# Altium project PCB_Project_1_board.PrjPcb
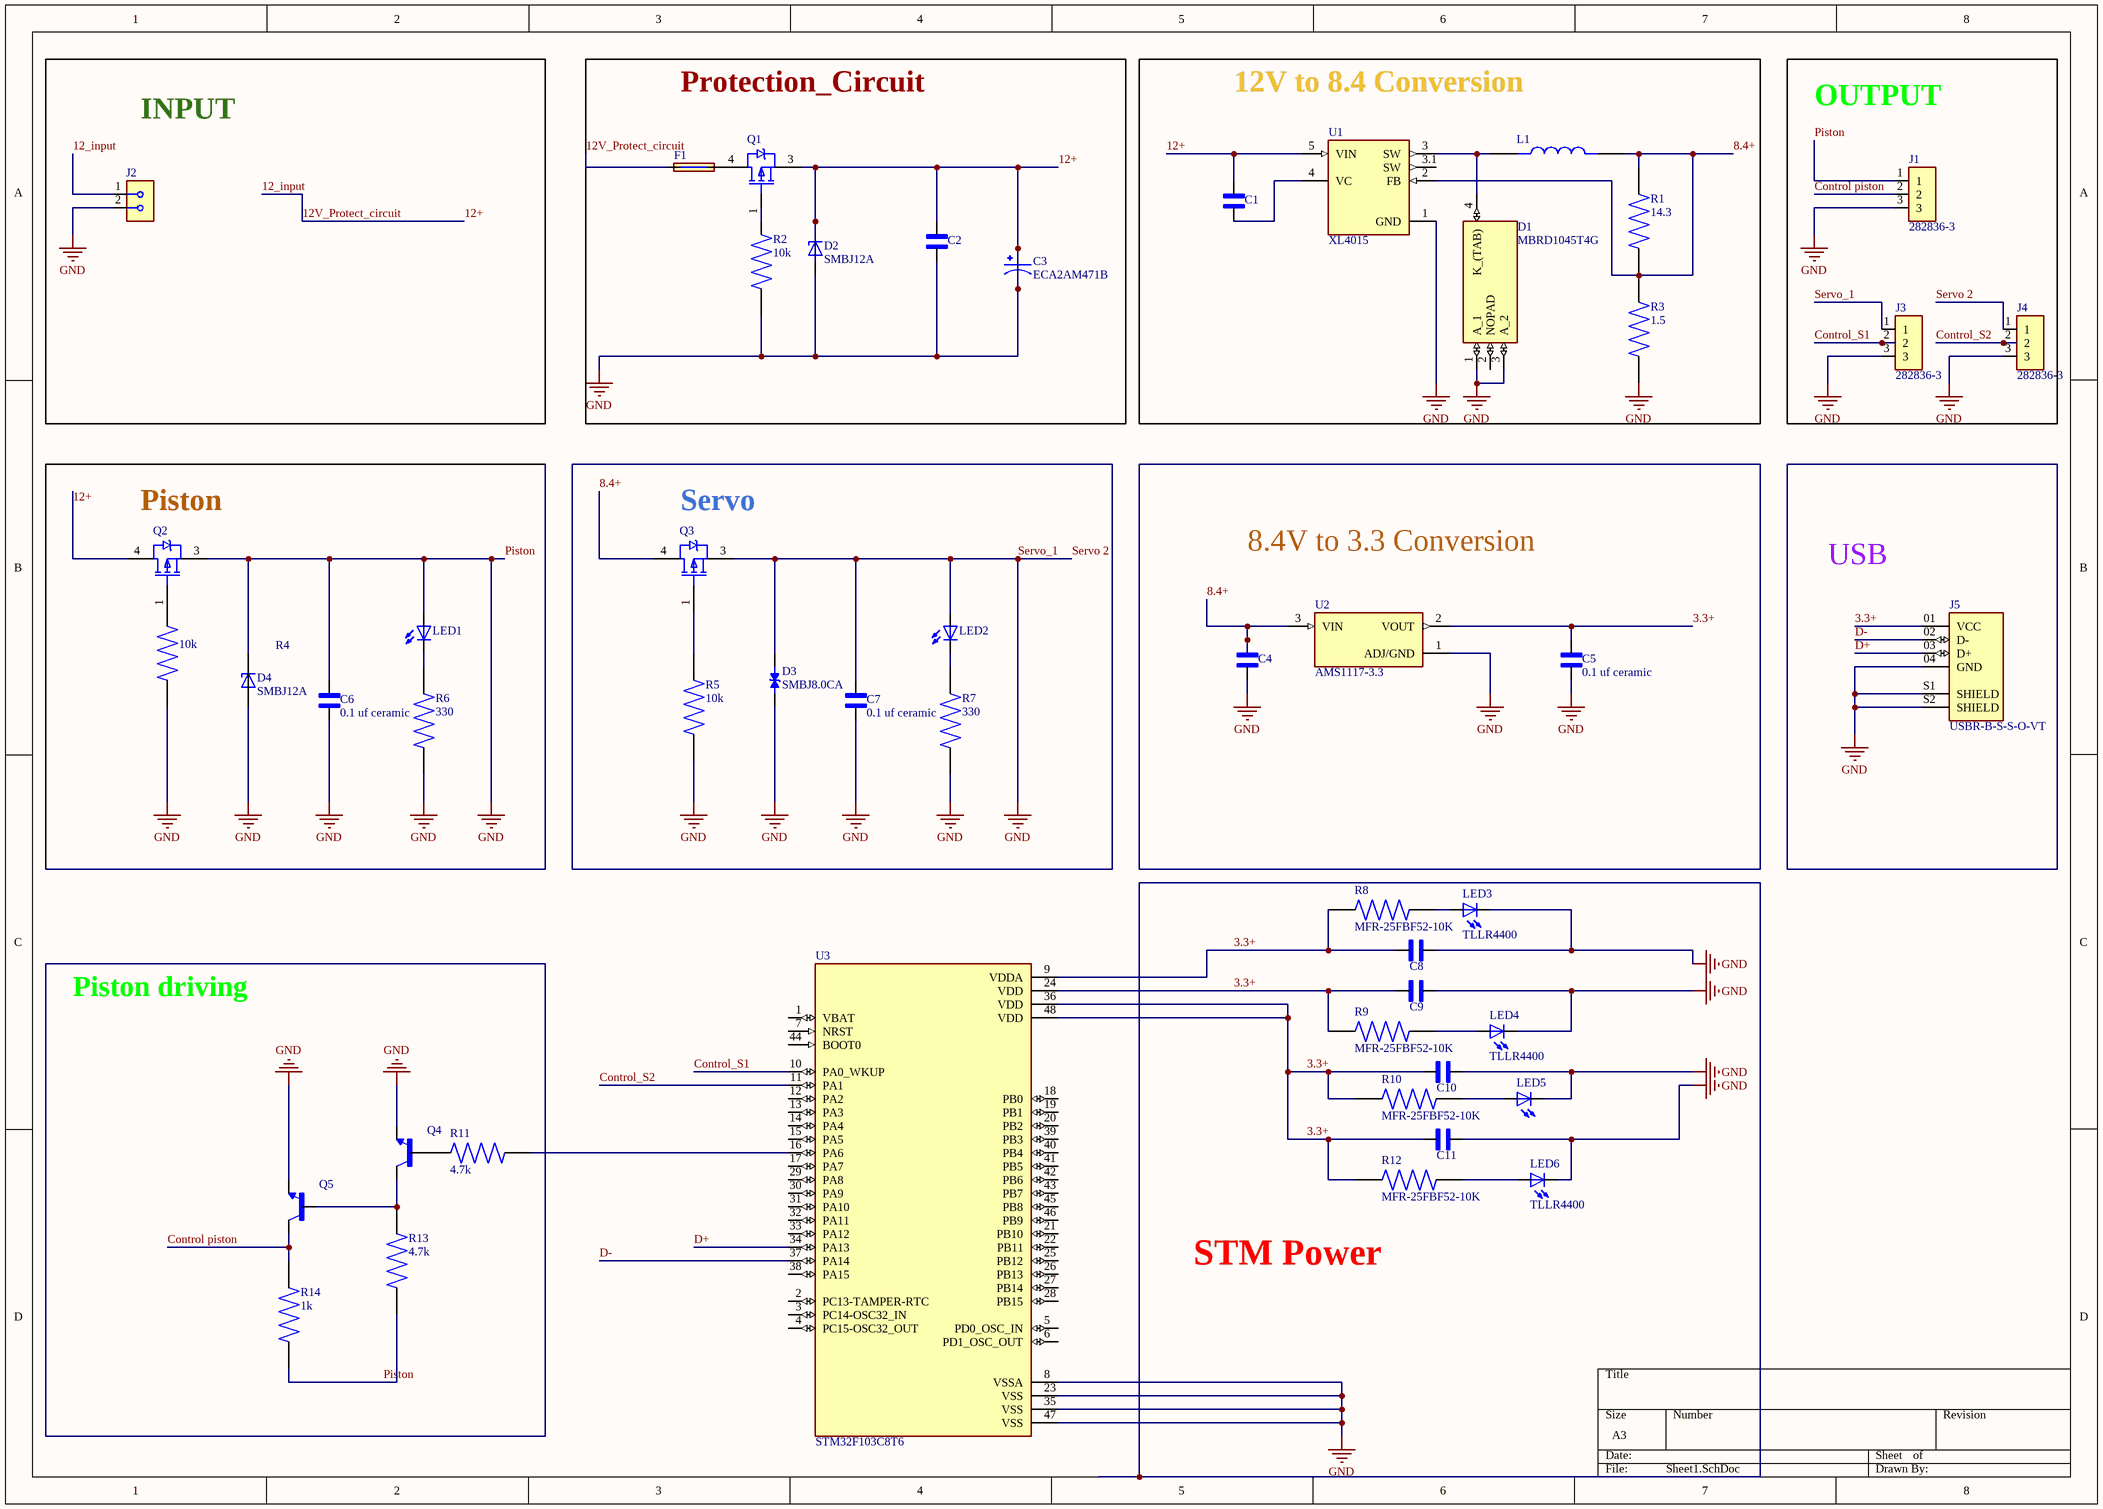
[diagram p0: Sheet1.SchDoc]
1 sheet, 50 parts. Net scope: global (net labels, ports and power ports of the same name join across sheets).
Board file: PCB1.PcbDoc

## Sheet Sheet1.SchDoc
size A3; SheetNumber: 1; SheetTotal: 1

### Parts
C1  CL10B105KO8NNNC  [CAPC1608X90N]  (value not drawn)
C2  FA14X8R1H104KNU06  [CAPRB250W50L450T300H550]  (value not drawn)
C3  ECA2AM471B  [CAPPRD750W80D1600H2500]
C4  0.1 uf ceramic  [CAPRB250W50L450T300H550]  (value not drawn)
C5  0.1 uf ceramic  [CAPRB250W50L450T300H550]
C6  0.1 uf ceramic  [CAPRB250W50L450T300H550]
C7  0.1 uf ceramic  [CAPRB250W50L450T300H550]
C8  0.1 uf ceramic  [CAPRB250W50L450T300H550]  (value not drawn)
C9  0.1 uf ceramic  [CAPRB250W50L450T300H550]  (value not drawn)
C10  0.1 uf ceramic  [CAPRB250W50L450T300H550]  (value not drawn)
C11  0.1 uf ceramic  [CAPRB250W50L450T300H550]  (value not drawn)
D1  MBRD1045T4G  [TO229P990X238-4N]
D2  SMBJ12A  [DIOM4336X265N]
D3  SMBJ8.0CA  [DIOM4336X265N]
D4  SMBJ12A  [DIOM4336X265N]
F1  0154007.DR  [0154007.DR]  (value not drawn)
J1  282836-3  [TE_282836-3]
J2  OSTTF020161  [OST_OSTTF020161]  (value not drawn)
J3  282836-3  [TE_282836-3]
J4  282836-3  [TE_282836-3]
J5  USBR-B-S-S-O-VT  [SAMTEC_USBR-B-S-S-O-VT]
L1  AMDLA1004S-470MT  [IND_AMDLA1004S-470MT]  (value not drawn)
LED1  TLLR4400  [LED3MM]  (value not drawn)
LED2  TLLR4400  [LED3MM]  (value not drawn)
LED3  TLLR4400  [LED3MM]
LED4  TLLR4400  [LED3MM]
LED5  TLLR4400  [LED3MM]  (value not drawn)
LED6  TLLR4400  [LED3MM]
Q1  MTB50P03HDLT4G  [ONSC-D2PAK-3-418B-04_V]  (value not drawn)
Q2  MTB50P03HDLT4G  [ONSC-D2PAK-3-418B-04_V]  (value not drawn)
Q3  MTB50P03HDLT4G  [ONSC-D2PAK-3-418B-04_V]  (value not drawn)
Q4  2N3904  [TO92254P460H750-3]  (value not drawn)
Q5  2N3904  [TO92254P460H750-3]  (value not drawn)
R1  14.3  [RESAD1100W55L680D260]
R2  10k  [RESAD1100W55L680D260]
R3  1.5  [RESAD1100W55L680D260]
R4  10k  [RESAD1100W55L680D260]
R5  10k  [RESAD1100W55L680D260]
R6  330  [RESAD1100W55L680D260]
R7  330  [RESAD1100W55L680D260]
R8  MFR-25FBF52-10K  [RESAD1100W55L680D260]
R9  MFR-25FBF52-10K  [RESAD1100W55L680D260]
R10  MFR-25FBF52-10K  [RESAD1100W55L680D260]
R11  4.7k  [RESAD1100W55L680D260]
R12  MFR-25FBF52-10K  [RESAD1100W55L680D260]
R13  4.7k  [RESAD1100W55L680D260]
R14  1k  [RESAD1100W55L680D260]
U1  XL4015  [CONV_XL4015]
U2  AMS1117-3.3  [SOT229P700X180-4N]
U3  STM32F103C8T6  [QFP50P900X900X160-48N]

### Blocks framed on the sheet
INPUT: J2
Protection_Circuit: C2 C3 D2 F1 Q1 R2
12V to 8.4 Conversion: C1 D1 L1 R1 R3 U1
OUTPUT: J1 J3 J4

### Nets
12+: C1.2 C2.1 C2.2 C3.N C3.P C4.1 C5.1 C6.1 C6.2 C7.1 C7.2 C8.1 C9.1 C10.1 C11.1 D1.1(A_1) D1.3(A_2) D2.A D2.C D3.1 D3.2 D4.A D4.C F1.1 J1.1 J1.3 J2.1 J2.2 J3.1 J3.3 J4.1 J4.3 J5.04(GND) J5.S1(SHIELD) J5.S2(SHIELD) LED1.A LED2.A LED3.K(C) LED4.K(C) LED5.K(C) LED6.K(C) Q1.3(S) Q2.3(S) Q2.4(D) Q3.3(S) Q4.1(E) Q5.1(E) R2.1 R3.1 R4.1 R5.1 R6.1 R7.1 R13.1 R14.1 U1.1(GND) U1.5(VIN) U2.1(ADJ/GND) U3.8(VSSA) U3.23(VSS) U3.35(VSS) U3.47(VSS)  [also labelled 12_input, 12V_Protect_circuit, GND, Piston, Servo 2, Servo_1]
3.3+: C5.2 C8.2 C9.2 C10.2 C11.2 J5.01(VCC) R8.1 R9.1 R10.1 R12.1 U2.2(VOUT) U3.9(VDDA) U3.24(VDD) U3.36(VDD) U3.48(VDD)
8.4+: C4.2 L1.2 Q3.4(D) R1.1 R1.2 R3.2 U1.2(FB) U2.3(VIN)
Control piston: J1.2 Q5.3(C) R14.2
Control_S1: J3.2 U3.10(PA0_WKUP)
Control_S2: J4.2 U3.11(PA1)
D+: J5.03(D+) U3.34(PA13)
D-: J5.02(D-) U3.37(PA14)
NetC1_1: C1.1 U1.4(VC)
NetD1_4: D1.4(K_(TAB)) L1.1 U1.3(SW)
NetF1_2: F1.2 Q1.4(D)
NetLED1_K: LED1.K(C) R6.2
NetLED2_K: LED2.K(C) R7.2
NetLED3_A: LED3.A R8.2
NetLED4_A: LED4.A R9.2
NetLED5_A: LED5.A R10.2
NetLED6_A: LED6.A R12.2
NetQ1_1: Q1.1(G) R2.2
NetQ3_1: Q3.1(G) R5.2
NetQ4_2: Q4.2(B) R11.1
NetQ4_3: Q4.3(C) Q5.2(B) R13.2
NetR11_2: R11.2 U3.16(PA6)

Not connected (* = marked no-connect by the designer): D1 2(NOPAD); Q2 1(G); R4 2; U1 3.1(SW); U3 1(VBAT) 2(PC13-TAMPER-RTC) 3(PC14-OSC32_IN) 4(PC15-OSC32_OUT) 5(PD0_OSC_IN) 6(PD1_OSC_OUT) 7(NRST) 12(PA2) 13(PA3) 14(PA4) 15(PA5) 17(PA7) 18(PB0) 19(PB1) 20(PB2) 21(PB10) 22(PB11) 25(PB12) 26(PB13) 27(PB14) 28(PB15) 29(PA8) 30(PA9) 31(PA10) 32(PA11) 33(PA12) 38(PA15) 39(PB3) 40(PB4) 41(PB5) 42(PB6) 43(PB7) 44(BOOT0) 45(PB8) 46(PB9)

### Notes on the sheet
- (near Q2) Piston
- (near Q3) Servo
- 8.4V to 3.3 Conversion
- USB
- Piston driving
- STM Power

### Library data of the parts
C1 = CL10B105KO8NNNC: 1 µF Â±10% 16V Ceramic Capacitor X7R 0603 (1608 Metric); MF: Samsung Electro-Mechanics; SnapEDA_Link: https://www.snapeda.com/parts/CL10B105KO8NNNC/Samsung/view-part/?ref=snap; Package: SMD-2 Samsung; Value: *; MP: CL10B105KO8NNNC; Check_prices: https://www.snapeda.com/parts/CL10B105KO8NNNC/Samsung/view-part/?ref=eda
C2 C4-C11 = FA14X8R1H104KNU06: 0.1 ÂµF Â±10% 50V Ceramic Capacitor X8R Radial; MF: TDK; SnapEDA_Link: https://www.snapeda.com/parts/FA14X8R1H104KNU06/TDK/view-part/?ref=snap; Package: Radial TDK; Value: *; MP: FA14X8R1H104KNU06; Check_prices: https://www.snapeda.com/parts/FA14X8R1H104KNU06/TDK/view-part/?ref=eda
C3 = ECA2AM471B: CAP ALUM 470UF 20% 100V RADIAL; MF: Panasonic; Check_prices: https://www.snapeda.com/parts/ECA2AM471B/Panasonic/view-part/?ref=eda; SnapEDA_Link: https://www.snapeda.com/parts/ECA2AM471B/Panasonic/view-part/?ref=snap; Availability: In Stock; Value: *; Price: None; MP: ECA2AM471B; Package: RADIAL-2 Panasonic; Purchase-URL: https://pricing.snapeda.com/search/part/ECA2AM471B/?ref=eda
D1 = MBRD1045T4G: Diode Schottky 45 V 10A Surface Mount DPAK; MF: ON Semiconductor; SnapEDA_Link: https://www.snapeda.com/parts/MBRD1045T4G/Onsemi/view-part/?ref=snap; Package: DPAK-3 ON Semiconductor; Value: *; MP: MBRD1045T4G; Check_prices: https://www.snapeda.com/parts/MBRD1045T4G/Onsemi/view-part/?ref=eda
D2 D4 = SMBJ12A: 600W, 14V, 5%, Unidirectional, TVS; MF: Taiwan Semiconductor Corporation; SnapEDA_Link: https://www.snapeda.com/parts/SMBJ12A/taiwan/view-part/?ref=snap; Package: SMD-2 Taiwan Semiconductor; Value: *; MP: SMBJ12A; Check_prices: https://www.snapeda.com/parts/SMBJ12A/taiwan/view-part/?ref=eda
D3 = SMBJ8.0CA: 600W, 9.4V, 5%, Bidirectional, TVS; MF: Taiwan Semiconductor; SnapEDA_Link: https://www.snapeda.com/parts/SMBJ8.0CA/taiwan/view-part/?ref=snap; Package: SMB Taiwan Semiconductor; Value: *; MP: SMBJ8.0CA; Check_prices: https://www.snapeda.com/parts/SMBJ8.0CA/taiwan/view-part/?ref=eda
F1 = 0154007.DR: 7 A 125 V AC 125 V DC Fuse Board Mount (Cartridge Style Excluded) Requires Holder, Surface Mount 2-SMD, Square End Block with Holder; MF: Littelfuse Inc.; Package: SMD-2 Littelfuse; Price: None; Check_prices: https://www.snapeda.com/parts/0154007.DR/Littelfuse+Inc./view-part/?ref=eda; Value: *; SnapEDA_Link: https://www.snapeda.com/parts/0154007.DR/Littelfuse+Inc./view-part/?ref=snap; MP: 0154007.DR; Availability: In Stock; Purchase-URL: https://pricing.snapeda.com/search?q=0154007.DR&ref=eda
J1 J3 J4 = 282836-3: TERM BLOCK 3POS SIDE ENTRY 5MM; Price: None; Value: *; Package: None; Availability: Unavailable; MP: 282836-3
J2 = OSTTF020161: 2 Position Wire to Board Terminal Block Vertical with Board 0.138 (3.50mm) Through Hole; MF: On Shore; SnapEDA_Link: https://www.snapeda.com/parts/OSTTF020161/ON/view-part/?ref=snap; Package: None; Value: *; MP: OSTTF020161; Check_prices: https://www.snapeda.com/parts/OSTTF020161/ON/view-part/?ref=eda
J5 = USBR-B-S-S-O-VT: MF: Samtec; Package: None; Value: *; MP: USBR-B-S-S-O-VT; Availability: Unavailable; Price: None
L1 = AMDLA1004S-470MT: FIXED IND 47UH 3.5A 143MOHM SMD; MF: Abracon LLC; MP: AMDLA1004S-470MT; Package: Package; Purchase-URL: https://pricing.snapeda.com/search/part/AMDLA1004S-470MT/?ref=eda; Check_prices: https://www.snapeda.com/parts/AMDLA1004S-470MT/Abracon+LLC/view-part/?ref=eda; SnapEDA_Link: https://www.snapeda.com/parts/AMDLA1004S-470MT/Abracon+LLC/view-part/?ref=snap; Availability: In Stock; Price: None; Value: *
LED1-LED6 = TLLR4400: Red 619nm LED Indication - Discrete 1.9V Radial; MF: Vishay; SnapEDA_Link: https://www.snapeda.com/parts/TLLR4400/Vishay+Semiconductor+Opto+Division/view-part/?ref=snap; Package: None; Value: *; MP: TLLR4400; Check_prices: https://www.snapeda.com/parts/TLLR4400/Vishay+Semiconductor+Opto+Division/view-part/?ref=eda
Q1-Q3 = MTB50P03HDLT4G: P-Channel 30 V 50A (Tc) 2.5W (Ta), 125W (Tc) Surface Mount DÂ²PAK; MF: ON Semiconductor; Check_prices: https://www.snapeda.com/parts/MTB50P03HDLT4G/Onsemi/view-part/?ref=eda; Availability: In Stock; Price: None; Package: D2PAK ON Semiconductor; Value: *; SnapEDA_Link: https://www.snapeda.com/parts/MTB50P03HDLT4G/Onsemi/view-part/?ref=snap; Purchase-URL: https://pricing.snapeda.com/search/part/MTB50P03HDLT4G/?ref=eda; MP: MTB50P03HDLT4G
Q4 Q5 = 2N3904: BJT, TO-92, 40V, 200mA, NPN, 0.625W, 150Â°C; MF: Diotec Semiconductor; SnapEDA_Link: https://www.snapeda.com/parts/2N3904/Diotec/view-part/?ref=snap; Package: TO-92 Diotec; Value: *; MP: 2N3904; Check_prices: https://www.snapeda.com/parts/2N3904/Diotec/view-part/?ref=eda
R1-R14 = MFR-25FBF52-10K: 10.2 kOhms Â±1% 0.25W, 1/4W Through Hole Resistor Axial - Metal Film; MF: Yageo; SnapEDA_Link: https://www.snapeda.com/parts/MFR-25FBF52-10K/Yageo/view-part/?ref=snap; Package: RADIAL-2 YAGEO; Value: *; MP: MFR-25FBF52-10K; Check_prices: https://www.snapeda.com/parts/MFR-25FBF52-10K/Yageo/view-part/?ref=eda
U1 = XL4015: 5A 180KHz 36V Buck DC to DC Converter; MF: XLSEMI; SnapEDA_Link: https://www.snapeda.com/parts/XL4015/XLSEMI/view-part/?ref=snap; Package: None; Value: *; MP: XL4015; Check_prices: https://www.snapeda.com/parts/XL4015/XLSEMI/view-part/?ref=eda
U2 = AMS1117-3.3: Linear Voltage Regulator IC Positive Fixed 1 Output 1A SOT-223-3L; MF: UMW; SnapEDA_Link: https://www.snapeda.com/parts/AMS1117-3.3/UMW/view-part/?ref=snap; Package: SOT-223-3L UMW; Value: *; MP: AMS1117-3.3; Check_prices: https://www.snapeda.com/parts/AMS1117-3.3/UMW/view-part/?ref=eda
U3 = STM32F103C8T6: ARM® Cortex®-M3 STM32F1 Microcontroller IC 32-Bit 72MHz 64KB (64K x 8) FLASH 48-LQFP (7x7); MF: STMicroelectronics; SnapEDA_Link: https://www.snapeda.com/parts/STM32F103C8T6/STMicroelectronics/view-part/?ref=snap; Package: LQFP-48 STMicroelectronics; Value: *; MP: STM32F103C8T6; Check_prices: https://www.snapeda.com/parts/STM32F103C8T6/STMicroelectronics/view-part/?ref=eda